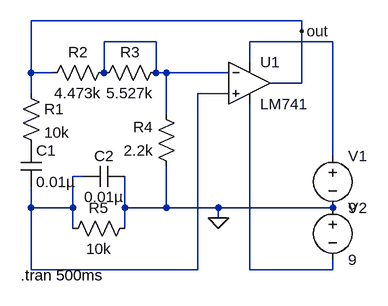
[diagram p0: schematic Draft1.asc]
Draft1.asc, the LTspice schematic file:
Version 4
SHEET 1 880 680
WIRE 288 -48 -128 -48
WIRE 288 -32 288 -48
WIRE 64 -16 -16 -16
WIRE 336 -16 208 -16
WIRE 208 16 208 -16
WIRE -128 32 -128 -48
WIRE -96 32 -128 32
WIRE -16 32 -16 -16
WIRE 64 32 64 -16
WIRE 80 32 64 32
WIRE 176 32 80 32
WIRE 288 48 288 -32
WIRE 288 48 240 48
WIRE -128 64 -128 32
WIRE 176 64 128 64
WIRE 80 96 80 32
WIRE 336 160 336 -16
WIRE -48 192 -64 192
WIRE -128 240 -128 208
WIRE -64 240 -64 192
WIRE -64 240 -128 240
WIRE 16 240 16 192
WIRE 80 240 80 176
WIRE 80 240 16 240
WIRE 160 240 80 240
WIRE 336 240 160 240
WIRE 160 256 160 240
WIRE -64 272 -64 240
WIRE 16 272 16 240
WIRE -128 336 -128 240
WIRE 128 336 128 64
WIRE 128 336 -128 336
WIRE 208 336 208 80
WIRE 336 336 336 320
WIRE 336 336 208 336
FLAG 160 256 0
FLAG 288 -32 out
SYMBOL OpAmps\\LM741 208 -16 R0
SYMATTR InstName U1
SYMBOL res -144 48 R0
SYMATTR InstName R1
SYMATTR Value 10k
SYMBOL cap -144 144 R0
SYMATTR InstName C1
SYMATTR Value 0.01µ
SYMBOL res 0 16 R90
WINDOW 0 0 56 VBottom 2
WINDOW 3 32 56 VTop 2
SYMATTR InstName R2
SYMATTR Value 4.473k
SYMBOL res 80 16 R90
WINDOW 0 0 56 VBottom 2
WINDOW 3 32 56 VTop 2
SYMATTR InstName R3
SYMATTR Value 5.527k
SYMBOL res 96 192 R180
WINDOW 0 36 76 Left 2
WINDOW 3 36 40 Left 2
SYMATTR InstName R4
SYMATTR Value 2.2k
SYMBOL cap 16 176 R90
WINDOW 0 0 32 VBottom 2
WINDOW 3 32 32 VTop 2
SYMATTR InstName C2
SYMATTR Value 0.01µ
SYMBOL res 32 256 R90
WINDOW 0 0 56 VBottom 2
WINDOW 3 32 56 VTop 2
SYMATTR InstName R5
SYMATTR Value 10k
SYMBOL voltage 336 144 R0
WINDOW 123 0 0 Left 0
WINDOW 39 0 0 Left 0
SYMATTR InstName V1
SYMATTR Value 9
SYMBOL voltage 336 224 R0
WINDOW 123 0 0 Left 0
WINDOW 39 0 0 Left 0
SYMATTR InstName V2
SYMATTR Value 9
TEXT -144 344 Left 2 !.tran 500ms

The netlist it stands for:
* Draft1.asc
XU1 N003 N001 N002 N004 out LM741  ; pins In+ In- V+ V- OUT
R1 out P001 10k
C1 P001 N003 0.01µ
R2 N001 out 4.473k
R3 N001 N001 5.527k
R4 0 N001 2.2k
C2 0 N003 0.01µ
R5 0 N003 10k
V1 N002 0 9
V2 0 N004 9
.tran 500ms
.lib LM741.lib
.backanno
.end